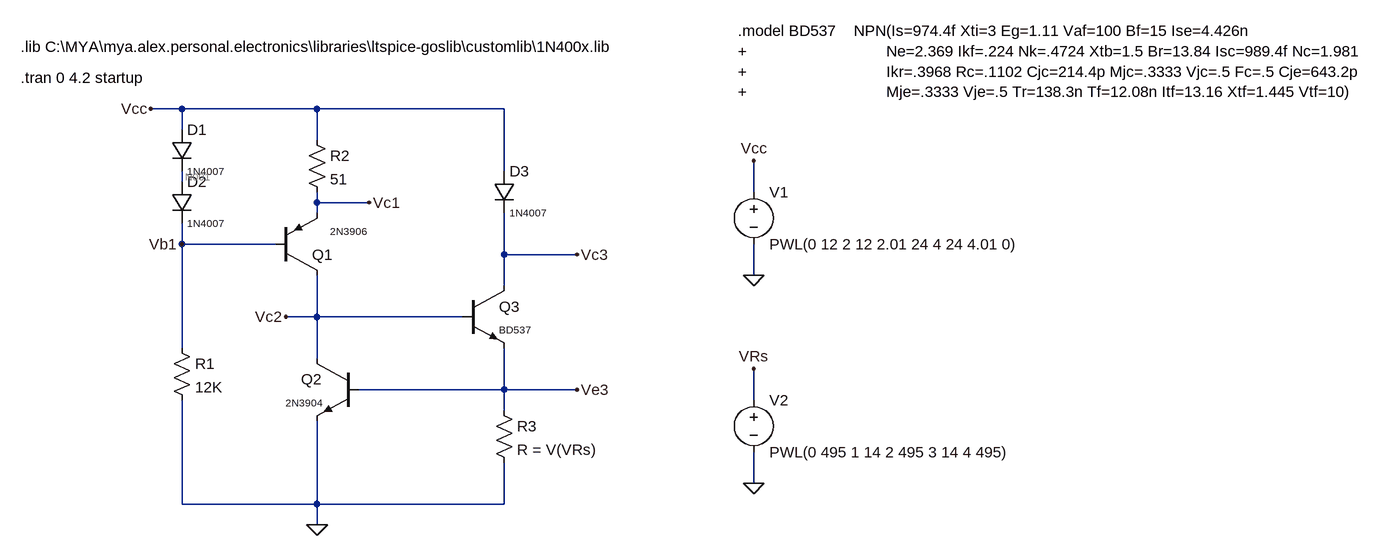
[diagram p0: schematic bjt-constant-current-generator.asc]
bjt-constant-current-generator.asc, the LTspice schematic file:
Version 4
SHEET 1 2644 740
WIRE -1856 -64 -1904 -64
WIRE -1648 -64 -1856 -64
WIRE -1360 -64 -1648 -64
WIRE -1856 -32 -1856 -64
WIRE -1648 -16 -1648 -64
WIRE -1360 32 -1360 -64
WIRE -1856 48 -1856 32
WIRE -976 64 -976 16
WIRE -1648 80 -1648 64
WIRE -1568 80 -1648 80
WIRE -1648 96 -1648 80
WIRE -1856 144 -1856 112
WIRE -1712 144 -1856 144
WIRE -1360 160 -1360 96
WIRE -1248 160 -1360 160
WIRE -976 192 -976 144
WIRE -1360 208 -1360 160
WIRE -1648 256 -1648 192
WIRE -1648 256 -1696 256
WIRE -1424 256 -1648 256
WIRE -1856 304 -1856 144
WIRE -1648 320 -1648 256
WIRE -1360 368 -1360 304
WIRE -1360 368 -1584 368
WIRE -1248 368 -1360 368
WIRE -976 384 -976 336
WIRE -1360 400 -1360 368
WIRE -976 512 -976 464
WIRE -1856 544 -1856 384
WIRE -1648 544 -1648 416
WIRE -1648 544 -1856 544
WIRE -1360 544 -1360 480
WIRE -1360 544 -1648 544
WIRE -1648 576 -1648 544
FLAG -976 192 0
FLAG -1856 144 Vb1
FLAG -976 16 Vcc
FLAG -1648 576 0
FLAG -1904 -64 Vcc
FLAG -1248 160 Vc3
FLAG -1248 368 Ve3
FLAG -1696 256 Vc2
FLAG -1568 80 Vc1
FLAG -976 512 0
FLAG -976 336 VRs
SYMBOL voltage -976 48 R0
WINDOW 123 0 0 Left 0
WINDOW 39 0 0 Left 0
SYMATTR InstName V1
SYMATTR Value PWL(0 12 2 12 2.01 24 4 24 4.01 0)
SYMBOL pnp -1712 192 M180
WINDOW 3 84 68 Left 1
SYMATTR Value 2N3906
SYMATTR InstName Q1
SYMBOL res -1664 -32 R0
SYMATTR InstName R2
SYMATTR Value 51
SYMBOL res -1872 288 R0
SYMATTR InstName R1
SYMATTR Value 12K
SYMBOL diode -1872 48 R0
WINDOW 3 24 64 Left 1
SYMATTR Value 1N4007
SYMATTR InstName D2
SYMBOL diode -1872 -32 R0
WINDOW 3 24 64 Left 1
SYMATTR Value 1N4007
SYMATTR InstName D1
SYMBOL npn -1584 320 M0
WINDOW 3 56 68 Left 1
SYMATTR Value 2N3904
SYMATTR InstName Q2
SYMBOL npn -1424 208 R0
WINDOW 3 56 68 Left 1
SYMATTR Value BD537
SYMATTR InstName Q3
SYMBOL res -1376 384 R0
SYMATTR InstName R3
SYMATTR Value R = V(VRs)
SYMBOL diode -1376 32 R0
WINDOW 3 24 64 Left 1
SYMATTR Value 1N4007
SYMATTR InstName D3
SYMBOL voltage -976 368 R0
WINDOW 123 0 0 Left 0
WINDOW 39 0 0 Left 0
SYMATTR InstName V2
SYMATTR Value PWL(0 495 1 14 2 495 3 14 4 495)
TEXT -2104 -112 Left 2 !.tran 0 4.2 startup
TEXT -2104 -160 Left 2 !.lib C:\\MYA\\mya.alex.personal.electronics\\libraries\\ltspice-goslib\\customlib\\1N400x.lib
TEXT -1000 -184 Left 2 !.model BD537    NPN(Is=974.4f Xti=3 Eg=1.11 Vaf=100 Bf=15 Ise=4.426n\n+                               Ne=2.369 Ikf=.224 Nk=.4724 Xtb=1.5 Br=13.84 Isc=989.4f Nc=1.981\n+                               Ikr=.3968 Rc=.1102 Cjc=214.4p Mjc=.3333 Vjc=.5 Fc=.5 Cje=643.2p\n+                               Mje=.3333 Vje=.5 Tr=138.3n Tf=12.08n Itf=13.16 Xtf=1.445 Vtf=10)

The netlist it stands for:
* bjt-constant-current-generator.asc
V1 Vcc 0 PWL(0 12 2 12 2.01 24 4 24 4.01 0)
Q1 Vc2 Vb1 Vc1 0 2N3906
R2 Vcc Vc1 51
R1 Vb1 0 12K
D2 N001 Vb1 1N4007
D1 Vcc N001 1N4007
Q2 Vc2 Ve3 0 0 2N3904
Q3 Vc3 Vc2 Ve3 0 BD537
R3 Ve3 0 R = V(VRs)
D3 Vcc Vc3 1N4007
V2 VRs 0 PWL(0 495 1 14 2 495 3 14 4 495)
.model D D
.lib standard.dio
.model NPN NPN
.model PNP PNP
.lib standard.bjt
.tran 0 4.2 startup
.lib C:\MYA\mya.alex.personal.electronics\libraries\ltspice-goslib\customlib\1N400x.lib
.model BD537    NPN(Is=974.4f Xti=3 Eg=1.11 Vaf=100 Bf=15 Ise=4.426n
+                               Ne=2.369 Ikf=.224 Nk=.4724 Xtb=1.5 Br=13.84 Isc=989.4f Nc=1.981
+                               Ikr=.3968 Rc=.1102 Cjc=214.4p Mjc=.3333 Vjc=.5 Fc=.5 Cje=643.2p
+                               Mje=.3333 Vje=.5 Tr=138.3n Tf=12.08n Itf=13.16 Xtf=1.445 Vtf=10)
.backanno
.end

* Results of the author's LTspice run, read from the files saved beside the schematic
* Operating Point, zero values left out:
*   V(vcc) = 12 V
*   V(vc2) = 1.251 V
*   V(vb1) = 10.9 V
*   V(vc1) = 11.61 V
*   V(n001) = 11.45 V
*   V(ve3) = 708.8 mV
*   V(vc3) = 11.43 V
*   V(vrs) = 495 V
*   I(R3) = 1.432 mA
*   Ic(Q3) = 1.345 mA
*   Ib(Q3) = 112.5 µA
*   Ie(Q3) = -1.457 mA
*   Ic(Q2) = 7.5 mA
*   Ib(Q2) = 25.33 µA
*   Ie(Q2) = -7.525 mA
*   Ic(Q1) = -7.612 mA
*   Ib(Q1) = -35.31 µA
*   Ie(Q1) = 7.647 mA
*   I(D3) = 1.345 mA
*   I(D1) = 873.3 µA
*   I(D2) = 873.3 µA
*   I(R1) = 908.6 µA
*   I(R2) = 7.647 mA
*   I(V1) = -9.866 mA
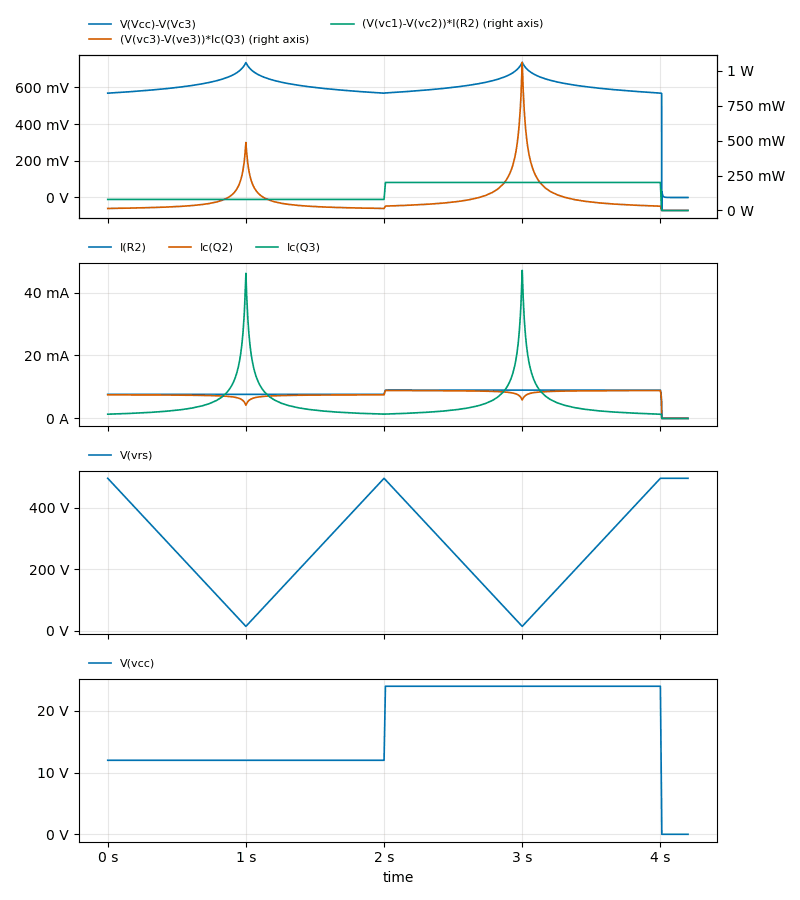
[diagram p1: Transient Analysis of bjt-constant-current-generator.asc, plotted from the saved traces]
* Transient Analysis, 1 run:
*   V(Vcc)-V(Vc3): min -70.7 mV, max 736.5 mV, average 583.4 mV, rms 598.1 mV, last 0 V
*   (V(vc3)-V(ve3))*Ic(Q3): min 0 W, max 1.061 W, average 78.74 mW, rms 138.3 mW, last 0 W
*   (V(vc1)-V(vc2))*I(R2): min 0 W, max 200.7 mW, average 133.2 mW, rms 148.7 mW, last 0 W
*   I(R2): min -27.48 nA, max 9.007 mA, average 7.945 mA, rms 8.159 mA, last 0 A
*   Ic(Q2): min -6.904 nA, max 8.863 mA, average 7.58 mA, rms 7.799 mA, last 0 A
*   Ic(Q3): min -10.79 nA, max 47.04 mA, average 4.721 mA, rms 7.794 mA, last 0 A
*   V(vrs): min 14 V, max 495 V, average 266 V, rms 303.5 V, last 495 V
*   V(vcc): min 0 V, max 24 V, average 17.16 V, rms 18.51 V, last 0 V